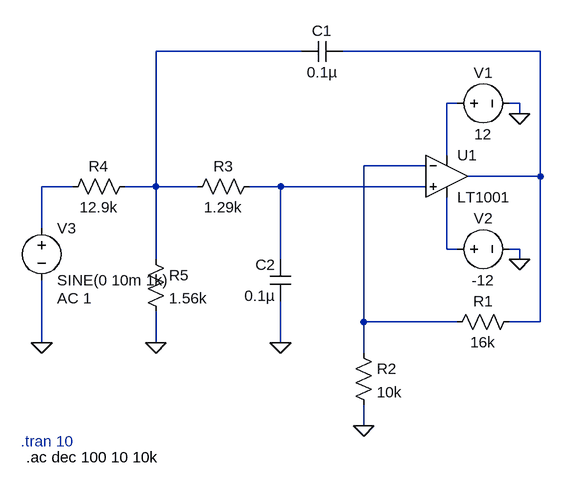
[diagram p0: schematic pasabajo.asc]
pasabajo.asc, the LTspice schematic file:
Version 4
SHEET 1 880 680
WIRE 0 -32 -224 -32
WIRE 368 -32 64 -32
WIRE 240 48 224 48
WIRE 336 48 320 48
WIRE 336 64 336 48
WIRE 224 128 224 48
WIRE 192 144 96 144
WIRE 368 160 368 -32
WIRE 368 160 256 160
WIRE -352 176 -400 176
WIRE -224 176 -224 -32
WIRE -224 176 -272 176
WIRE -160 176 -224 176
WIRE -32 176 -80 176
WIRE 192 176 -32 176
WIRE -400 240 -400 176
WIRE 224 272 224 192
WIRE 240 272 224 272
WIRE 336 272 320 272
WIRE -224 288 -224 176
WIRE -32 288 -32 176
WIRE 336 288 336 272
WIRE 96 384 96 144
WIRE 240 384 96 384
WIRE 368 384 368 160
WIRE 368 384 320 384
WIRE -400 416 -400 320
WIRE -224 416 -224 368
WIRE -32 416 -32 352
WIRE 96 432 96 384
WIRE 96 544 96 512
FLAG 336 64 0
FLAG 336 288 0
FLAG 96 544 0
FLAG -32 416 0
FLAG -224 416 0
FLAG -400 416 0
SYMBOL OpAmps\\LT1001 224 96 R0
SYMATTR InstName U1
SYMBOL cap 64 -48 R90
WINDOW 0 0 32 VBottom 2
WINDOW 3 32 32 VTop 2
SYMATTR InstName C1
SYMATTR Value 0.1µ
SYMBOL voltage 224 48 R270
WINDOW 0 32 56 VTop 2
WINDOW 3 -32 56 VBottom 2
WINDOW 123 0 0 Left 0
WINDOW 39 0 0 Left 0
SYMATTR InstName V1
SYMATTR Value 12
SYMBOL voltage 224 272 R270
WINDOW 0 32 56 VTop 2
WINDOW 3 -32 56 VBottom 2
WINDOW 123 0 0 Left 0
WINDOW 39 0 0 Left 0
SYMATTR InstName V2
SYMATTR Value -12
SYMBOL res 336 368 R90
WINDOW 0 0 56 VBottom 2
WINDOW 3 32 56 VTop 2
SYMATTR InstName R1
SYMATTR Value 16k
SYMBOL res 80 416 R0
SYMATTR InstName R2
SYMATTR Value 10k
SYMBOL cap -16 352 R180
WINDOW 0 24 56 Left 2
WINDOW 3 24 8 Left 2
SYMATTR InstName C2
SYMATTR Value 0.1µ
SYMBOL res -64 160 R90
WINDOW 0 0 56 VBottom 2
WINDOW 3 32 56 VTop 2
SYMATTR InstName R3
SYMATTR Value 1.29k
SYMBOL res -256 160 R90
WINDOW 0 0 56 VBottom 2
WINDOW 3 32 56 VTop 2
SYMATTR InstName R4
SYMATTR Value 12.9k
SYMBOL res -240 272 R0
SYMATTR InstName R5
SYMATTR Value 1.56k
SYMBOL voltage -400 224 R0
WINDOW 123 24 124 Left 2
WINDOW 39 24 152 Left 2
SYMATTR Value2 AC 1
SYMATTR InstName V3
SYMATTR Value SINE(0 10m 1k)
TEXT -432 568 Left 2 ;.tran 10
TEXT -424 592 Left 2 !.ac dec 100 10 10k

The netlist it stands for:
* pasabajo.asc
XU1 N006 N004 N003 N007 N002 LT1001  ; pins In+ In- V+ V- OUT
C1 N002 N001 0.1µ
V1 N003 0 12
V2 N007 0 -12
R1 N002 N004 16k
R2 N004 0 10k
C2 0 N006 0.1µ
R3 N006 N001 1.29k
R4 N001 N005 12.9k
R5 N001 0 1.56k
V3 N005 0 SINE(0 10m 1k) AC 1
* .tran 10
.ac dec 100 10 10k
.lib LTC.lib
.backanno
.end